# Altium schematic sheet Mako DSP Audio Codec.SchDoc
size A
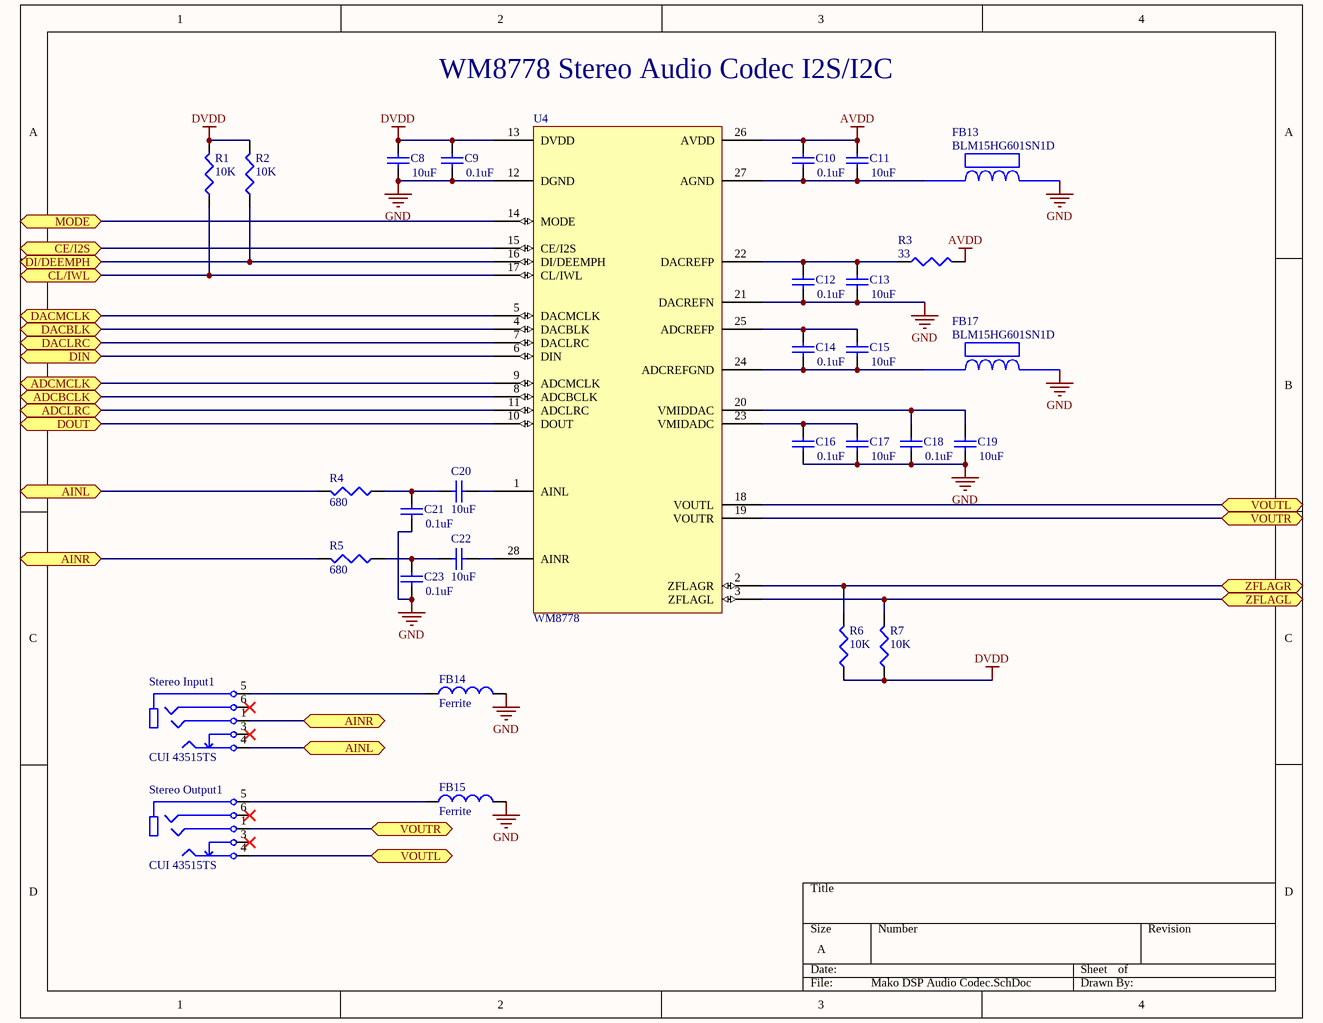
[diagram p0: Mako DSP Audio Codec.SchDoc]

## Parts
C8  value 10uF  [1608[0603]]  (hidden comment: Cap Semi)
C9  value 0.1uF  [1608[0603]]  (hidden comment: Cap Semi)
C10  value 0.1uF  [1608[0603]]  (hidden comment: Cap Semi)
C11  value 10uF  [1608[0603]]  (hidden comment: Cap Semi)
C12  value 0.1uF  [1608[0603]]  (hidden comment: Cap Semi)
C13  value 10uF  [1608[0603]]  (hidden comment: Cap Semi)
C14  value 0.1uF  [1608[0603]]  (hidden comment: Cap Semi)
C15  value 10uF  [1608[0603]]  (hidden comment: Cap Semi)
C16  value 0.1uF  [1608[0603]]  (hidden comment: Cap Semi)
C17  value 10uF  [1608[0603]]  (hidden comment: Cap Semi)
C18  value 0.1uF  [1608[0603]]  (hidden comment: Cap Semi)
C19  value 10uF  [1608[0603]]  (hidden comment: Cap Semi)
C20  value 10uF  [Panasonic VS B]  (hidden comment: Cap Semi)
C21  value 0.1uF  [SM 0805 - gap trimmed]  (hidden comment: Cap Semi)
C22  value 10uF  [Panasonic VS B]  (hidden comment: Cap Semi)
C23  value 0.1uF  [SM 0805 - gap trimmed]  (hidden comment: Cap Semi)
FB13  BLM15HG601SN1D  [BLM18PG121SN1D]
FB14  Ferrite  [SM 0805 - gap trimmed]
FB15  Ferrite  [SM 0805 - gap trimmed]
FB17  BLM15HG601SN1D  [BLM18PG121SN1D]
R1  value 10K  [J1-0603]  (hidden comment: Res3)
R2  value 10K  [J1-0603]  (hidden comment: Res3)
R3  value 33  [J1-0603]  (hidden comment: Res3)
R4  value 680  [SM 0805 - gap trimmed]  (hidden comment: Res3)
R5  value 680  [SM 0805 - gap trimmed]  (hidden comment: Res3)
R6  value 10K  [J1-0603]  (hidden comment: Res3)
R7  value 10K  [J1-0603]  (hidden comment: Res3)
Stereo_Input1  CUI 43515TS  [CUI SJ-43515TS]
Stereo_Output1  CUI 43515TS  [CUI SJ-43515TS]
U4  WM8778  [WM8778]

## Ports
ADCBCLK (bidir), ADCLRC (bidir), ADCMCLK (bidir), AINL, AINR, CE/I2S (bidir), CL/IWL (bidir), DACBLK (bidir), DACLRC (bidir), DACMCLK (bidir), DI/DEEMPH (bidir), DIN (bidir), DOUT (bidir), MODE (bidir), VOUTL, VOUTR, ZFLAGL (bidir), ZFLAGR (bidir)

## Nets
AVDD: C10.2 C11.2 R3.2 U4.26(AVDD)
DVDD: C8.2 C9.2 R1.2 R2.2 R6.1 R7.1 U4.13(DVDD)
GND: C8.1 C9.1 C12.1 C13.1 C16.1 C17.1 C18.1 C19.1 C21.1 C23.1 FB13.2 FB14.2 FB15.2 FB17.2 U4.12(DGND) U4.21(DACREFN)
ADCBCLK: U4.8(ADCBCLK) ; port ADCBCLK
ADCLRC: U4.11(ADCLRC) ; port ADCLRC
ADCMCLK: U4.9(ADCMCLK) ; port ADCMCLK
AINL: R4.2 Stereo_Input1.4(TIP) ; port AINL
AINR: R5.2 Stereo_Input1.1(R1) ; port AINR
CE/I2S: U4.15(CE/I2S) ; port CE/I2S
CL/IWL: R1.1 U4.17(CL/IWL) ; port CL/IWL
DACBLK: U4.4(DACBLK) ; port DACBLK
DACLRC: U4.7(DACLRC) ; port DACLRC
DACMCLK: U4.5(DACMCLK) ; port DACMCLK
DI/DEEMPH: R2.1 U4.16(DI/DEEMPH) ; port DI/DEEMPH
DIN: U4.6(DIN) ; port DIN
DOUT: U4.10(DOUT) ; port DOUT
MODE: U4.14(MODE) ; port MODE
VOUTL: Stereo_Output1.4(TIP) U4.18(VOUTL) ; port VOUTL
VOUTR: Stereo_Output1.1(R1) U4.19(VOUTR) ; port VOUTR
ZFLAGL: R7.2 U4.3(ZFLAGL) ; port ZFLAGL
ZFLAGR: R6.2 U4.2(ZFLAGR) ; port ZFLAGR
NetC10_1: C10.1 C11.1 FB13.1 U4.27(AGND)
NetC12_2: C12.2 C13.2 R3.1 U4.22(DACREFP)
NetC14_1: C14.1 C15.1 FB17.1 U4.24(ADCREFGND)
NetC14_2: C14.2 C15.2 U4.25(ADCREFP)
NetC16_2: C16.2 C17.2 U4.23(VMIDADC)
NetC18_2: C18.2 C19.2 U4.20(VMIDDAC)
NetC20_1: C20.1 U4.1(AINL)
NetC20_2: C20.2 C21.2 R4.1
NetC22_1: C22.1 U4.28(AINR)
NetC22_2: C22.2 C23.2 R5.1
NetFB14_1: FB14.1 Stereo_Input1.5(SLEEVE)
NetFB15_1: FB15.1 Stereo_Output1.5(SLEEVE)

Not connected (* = marked no-connect by the designer): Stereo_Input1 3(TS)* 6(R2)*; Stereo_Output1 3(TS)* 6(R2)*

## Notes on the sheet
- WM8778 Stereo Audio Codec I2S/I2C

## Library data of the parts
C8-C23 = Cap Semi: Capacitor (Semiconductor SIM Model); Published: 8-Jun-2000; LatestRevisionDate: 29-May-2009; LatestRevisionNote: IPC-7351 Footprint Added.; PackageReference: C1206; Publisher: Altium Limited; PackageDescription: Chip Capacitor
FB14 FB15 = Inductor: Code_IEC: 1005; Published: 8-Jun-2000; LatestRevisionDate: 17-Jul-2002; LatestRevisionNote: Re-released for DXP Platform.; PackageReference: 0402-A; Publisher: Altium Limited; Code_JEITA: 0402
R1-R7 = Res3: Resistor; Published: 8-Jun-2000; LatestRevisionDate: 29-May-2009; LatestRevisionNote: IPC-7351 Footprint Added.; PackageReference: J1-0603; Publisher: Altium Limited; PackageDescription: Chip Resistor